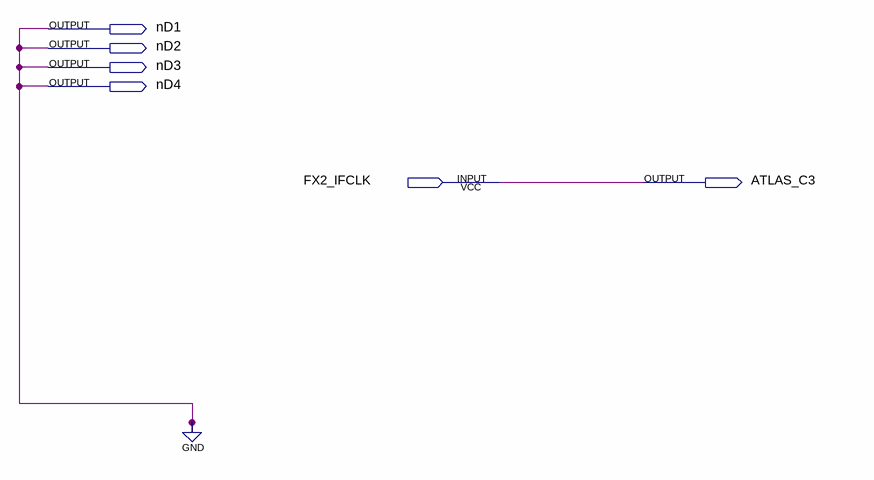
[diagram p0: schematic sheet]
// Quartus schematic Connectivity.bdf as structural Verilog: 0 symbols, 6 pins
module Connectivity (
  input  FX2_IFCLK,
  output nD1,
  output nD2,
  output nD3,
  output nD4,
  output ATLAS_C3
);


  assign ATLAS_C3 = FX2_IFCLK;
  assign nD1 = 1'b0;
  assign nD2 = 1'b0;
  assign nD3 = 1'b0;
  assign nD4 = 1'b0;
endmodule
